# EAGLE schematic protoTop (EAGLE 5.06)

## Sheet 1 of 5
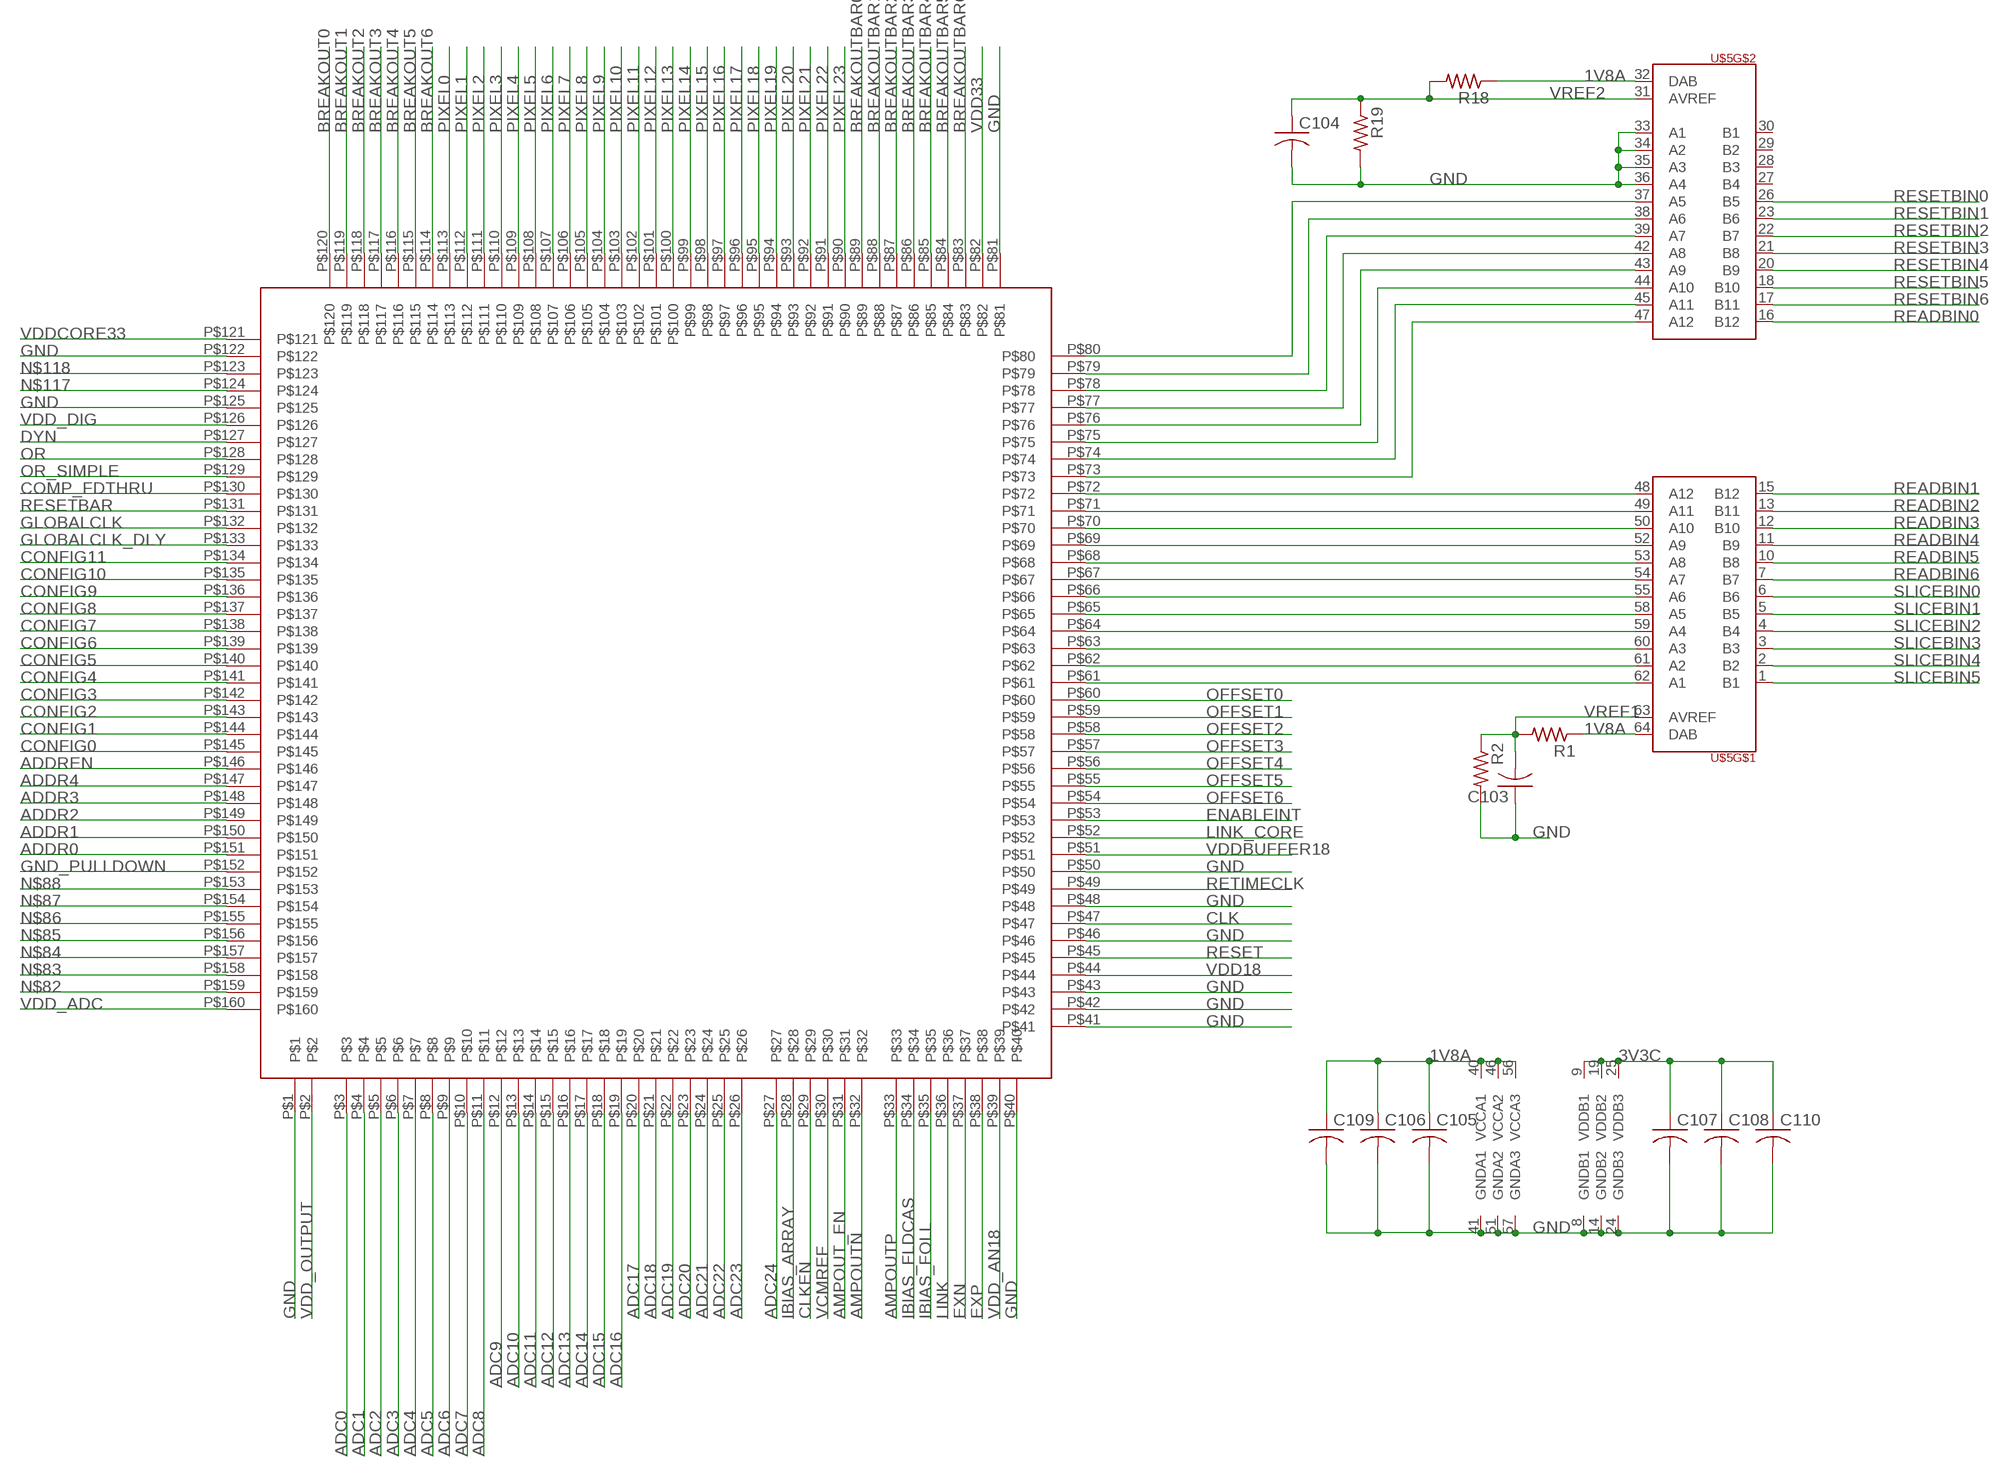
[diagram p0: schematic, sheet 1]

### Parts
C103  C-USC0603  [C0603]
C104  C-USC0603  [C0603]
C105  C-USC0603  [C0603]
C106  C-USC0603  [C0603]
C107  C-USC0603  [C0603]
C108  C-USC0603  [C0603]
C109  C-USC0603  [C0603]
C110  C-USC0603  [C0603]
R1  R-US_R0603  [R0603]
R2  R-US_R0603  [R0603]
R18  R-US_R0603  [R0603]
R19  R-US_R0603  [R0603]
U$1  DEC09_18RF  [CQZ160]
U$5  74HSTL1212  [TSSOP-64]

### Nets
1V8A: C105.1 C106.1 C109.1 R1.1 R18.1 U$5.32(DAB) U$5.40(VCCA1) U$5.46(VCCA2) U$5.56(VCCA3) U$5.64(DAB) ; also sheet 2,4,5
3V3C: C107.1 C108.1 C110.1 U$5.9(VDDB1) U$5.19(VDDB2) U$5.25(VDDB3) ; also sheet 4
ADC0: U$1.P$3 ; also sheet 4
ADC1: U$1.P$4 ; also sheet 4
ADC2: U$1.P$5 ; also sheet 4
ADC3: U$1.P$6 ; also sheet 4
ADC4: U$1.P$7 ; also sheet 4
ADC5: U$1.P$8 ; also sheet 4
ADC6: U$1.P$9 ; also sheet 4
ADC7: U$1.P$10 ; also sheet 4
ADC8: U$1.P$11 ; also sheet 4
ADC9: U$1.P$12 ; also sheet 4
ADC10: U$1.P$13 ; also sheet 4
ADC11: U$1.P$14 ; also sheet 4
ADC12: U$1.P$15 ; also sheet 4
ADC13: U$1.P$16 ; also sheet 4
ADC14: U$1.P$17 ; also sheet 4
ADC15: U$1.P$18 ; also sheet 4
ADC16: U$1.P$19 ; also sheet 4
ADC17: U$1.P$20 ; also sheet 4
ADC18: U$1.P$21 ; also sheet 4
ADC19: U$1.P$22 ; also sheet 4
ADC20: U$1.P$23 ; also sheet 4
ADC21: U$1.P$24 ; also sheet 4
ADC22: U$1.P$25 ; also sheet 4
ADC23: U$1.P$26 ; also sheet 4
ADC24: U$1.P$27 ; also sheet 4
ADDR0: U$1.P$151 ; also sheet 4
ADDR1: U$1.P$150 ; also sheet 4
ADDR2: U$1.P$149 ; also sheet 4
ADDR3: U$1.P$148 ; also sheet 4
ADDR4: U$1.P$147 ; also sheet 4
ADDREN: U$1.P$146 ; also sheet 4
AMPOUT_EN: U$1.P$31 ; also sheet 4
AMPOUTN: U$1.P$32 ; also sheet 4
AMPOUTP: U$1.P$33 ; also sheet 4
BREAKOUT0: U$1.P$120 ; also sheet 4
BREAKOUT1: U$1.P$119 ; also sheet 4
BREAKOUT2: U$1.P$118 ; also sheet 4
BREAKOUT3: U$1.P$117 ; also sheet 4
BREAKOUT4: U$1.P$116 ; also sheet 4
BREAKOUT5: U$1.P$115 ; also sheet 4
BREAKOUT6: U$1.P$114 ; also sheet 4
BREAKOUTBAR0: U$1.P$89 ; also sheet 4
BREAKOUTBAR1: U$1.P$88 ; also sheet 4
BREAKOUTBAR2: U$1.P$87 ; also sheet 4
BREAKOUTBAR3: U$1.P$86 ; also sheet 4
BREAKOUTBAR4: U$1.P$85 ; also sheet 4
BREAKOUTBAR5: U$1.P$84 ; also sheet 4
BREAKOUTBAR6: U$1.P$83 ; also sheet 4
CLK: U$1.P$47 ; also sheet 2
CLKEN: U$1.P$29 ; also sheet 4
COMP_FDTHRU: U$1.P$130 ; also sheet 4
CONFIG0: U$1.P$145 ; also sheet 4
CONFIG1: U$1.P$144 ; also sheet 4
CONFIG2: U$1.P$143 ; also sheet 4
CONFIG3: U$1.P$142 ; also sheet 4
CONFIG4: U$1.P$141 ; also sheet 4
CONFIG5: U$1.P$140 ; also sheet 4
CONFIG6: U$1.P$139 ; also sheet 4
CONFIG7: U$1.P$138 ; also sheet 4
CONFIG8: U$1.P$137 ; also sheet 4
CONFIG9: U$1.P$136 ; also sheet 4
CONFIG10: U$1.P$135 ; also sheet 4
CONFIG11: U$1.P$134 ; also sheet 4
DYN: U$1.P$127 ; also sheet 4
ENABLEINT: U$1.P$53 ; also sheet 4
EXN: U$1.P$37 ; also sheet 4
EXP: U$1.P$38 ; also sheet 4
GLOBALCLK: U$1.P$132 ; also sheet 4
GLOBALCLK_DLY: U$1.P$133 ; also sheet 4
GND: C103.1 C104.2 C105.2 C106.2 C107.2 C108.2 C109.2 C110.2 R2.2 R19.2 U$1.P$1 U$1.P$40 U$1.P$41 U$1.P$42 U$1.P$43 U$1.P$46 U$1.P$48 U$1.P$50 U$1.P$81 U$1.P$122 U$1.P$125 U$5.8(GNDB1) U$5.14(GNDB2) U$5.24(GNDB3) U$5.33(A1) U$5.34(A2) U$5.35(A3) U$5.36(A4) U$5.41(GNDA1) U$5.51(GNDA2) U$5.57(GNDA3) ; also sheet 2,3,4,5
GND_PULLDOWN: U$1.P$152 ; also sheet 4
IBIAS_ARRAY: U$1.P$28 ; also sheet 3,4
IBIAS_FLDCAS: U$1.P$34 ; also sheet 3,4
IBIAS_FOLL: U$1.P$35 ; also sheet 3,4
LINK: U$1.P$36 ; also sheet 4
LINK_CORE: U$1.P$52 ; also sheet 4
N$13: U$1.P$61 U$5.62(A1)
N$17: U$1.P$62 U$5.61(A2)
N$18: U$1.P$63 U$5.60(A3)
N$26: U$1.P$64 U$5.59(A4)
N$27: U$1.P$65 U$5.58(A5)
N$28: U$1.P$66 U$5.55(A6)
N$32: U$1.P$72 U$5.48(A12)
N$34: U$1.P$71 U$5.49(A11)
N$35: U$1.P$70 U$5.50(A10)
N$36: U$1.P$69 U$5.52(A9)
N$37: U$1.P$68 U$5.53(A8)
N$38: U$1.P$67 U$5.54(A7)
N$39: U$1.P$73 U$5.47(A12)
N$41: U$1.P$74 U$5.45(A11)
N$42: U$1.P$75 U$5.44(A10)
N$43: U$1.P$76 U$5.43(A9)
N$44: U$1.P$77 U$5.42(A8)
N$45: U$1.P$78 U$5.39(A7)
N$46: U$1.P$79 U$5.38(A6)
N$47: U$1.P$80 U$5.37(A5)
N$82: U$1.P$159
N$83: U$1.P$158
N$84: U$1.P$157
N$85: U$1.P$156
N$86: U$1.P$155
N$87: U$1.P$154
N$88: U$1.P$153
N$117: U$1.P$124
N$118: U$1.P$123
OFFSET0: U$1.P$60 ; also sheet 4
OFFSET1: U$1.P$59 ; also sheet 4
OFFSET2: U$1.P$58 ; also sheet 4
OFFSET3: U$1.P$57 ; also sheet 4
OFFSET4: U$1.P$56 ; also sheet 4
OFFSET5: U$1.P$55 ; also sheet 4
OFFSET6: U$1.P$54 ; also sheet 4
OR: U$1.P$128 ; also sheet 4
OR_SIMPLE: U$1.P$129 ; also sheet 4
PIXEL0: U$1.P$113 ; also sheet 4
PIXEL1: U$1.P$112 ; also sheet 4
PIXEL2: U$1.P$111 ; also sheet 4
PIXEL3: U$1.P$110 ; also sheet 4
PIXEL4: U$1.P$109 ; also sheet 4
PIXEL5: U$1.P$108 ; also sheet 4
PIXEL6: U$1.P$107 ; also sheet 4
PIXEL7: U$1.P$106 ; also sheet 4
PIXEL8: U$1.P$105 ; also sheet 4
PIXEL9: U$1.P$104 ; also sheet 4
PIXEL10: U$1.P$103 ; also sheet 4
PIXEL11: U$1.P$102 ; also sheet 4
PIXEL12: U$1.P$101 ; also sheet 4
PIXEL13: U$1.P$100 ; also sheet 4
PIXEL14: U$1.P$99 ; also sheet 4
PIXEL15: U$1.P$98 ; also sheet 4
PIXEL16: U$1.P$97 ; also sheet 4
PIXEL17: U$1.P$96 ; also sheet 4
PIXEL18: U$1.P$95 ; also sheet 4
PIXEL19: U$1.P$94 ; also sheet 4
PIXEL20: U$1.P$93 ; also sheet 4
PIXEL21: U$1.P$92 ; also sheet 4
PIXEL22: U$1.P$91 ; also sheet 4
PIXEL23: U$1.P$90 ; also sheet 4
READBIN0: U$5.16(B12) ; also sheet 4
READBIN1: U$5.15(B12) ; also sheet 4
READBIN2: U$5.13(B11) ; also sheet 4
READBIN3: U$5.12(B10) ; also sheet 4
READBIN4: U$5.11(B9) ; also sheet 4
READBIN5: U$5.10(B8) ; also sheet 4
READBIN6: U$5.7(B7) ; also sheet 4
RESET: U$1.P$45 ; also sheet 4
RESETBAR: U$1.P$131 ; also sheet 4
RESETBIN0: U$5.26(B5) ; also sheet 4
RESETBIN1: U$5.23(B6) ; also sheet 4
RESETBIN2: U$5.22(B7) ; also sheet 4
RESETBIN3: U$5.21(B8) ; also sheet 4
RESETBIN4: U$5.20(B9) ; also sheet 4
RESETBIN5: U$5.18(B10) ; also sheet 4
RESETBIN6: U$5.17(B11) ; also sheet 4
RETIMECLK: U$1.P$49 ; also sheet 2
SLICEBIN0: U$5.6(B6) ; also sheet 4
SLICEBIN1: U$5.5(B5) ; also sheet 4
SLICEBIN2: U$5.4(B4) ; also sheet 4
SLICEBIN3: U$5.3(B3) ; also sheet 4
SLICEBIN4: U$5.2(B2) ; also sheet 4
SLICEBIN5: U$5.1(B1) ; also sheet 4
VCMREF: U$1.P$30 ; also sheet 4
VDD18: U$1.P$44 ; also sheet 3,5
VDD33: U$1.P$82 ; also sheet 3,5
VDD_ADC: U$1.P$160 ; also sheet 3,5
VDD_AN18: U$1.P$39 ; also sheet 3,5
VDD_DIG: U$1.P$126 ; also sheet 3,5
VDD_OUTPUT: U$1.P$2 ; also sheet 3,5
VDDBUFFER18: U$1.P$51 ; also sheet 3,5
VDDCORE33: U$1.P$121 ; also sheet 3,5
VREF1: C103.2 R1.2 R2.1 U$5.63(AVREF)
VREF2: C104.1 R18.2 R19.1 U$5.31(AVREF)
Unconnected: U$5.27(B4) U$5.28(B3) U$5.29(B2) U$5.30(B1)

## Sheet 2 of 5
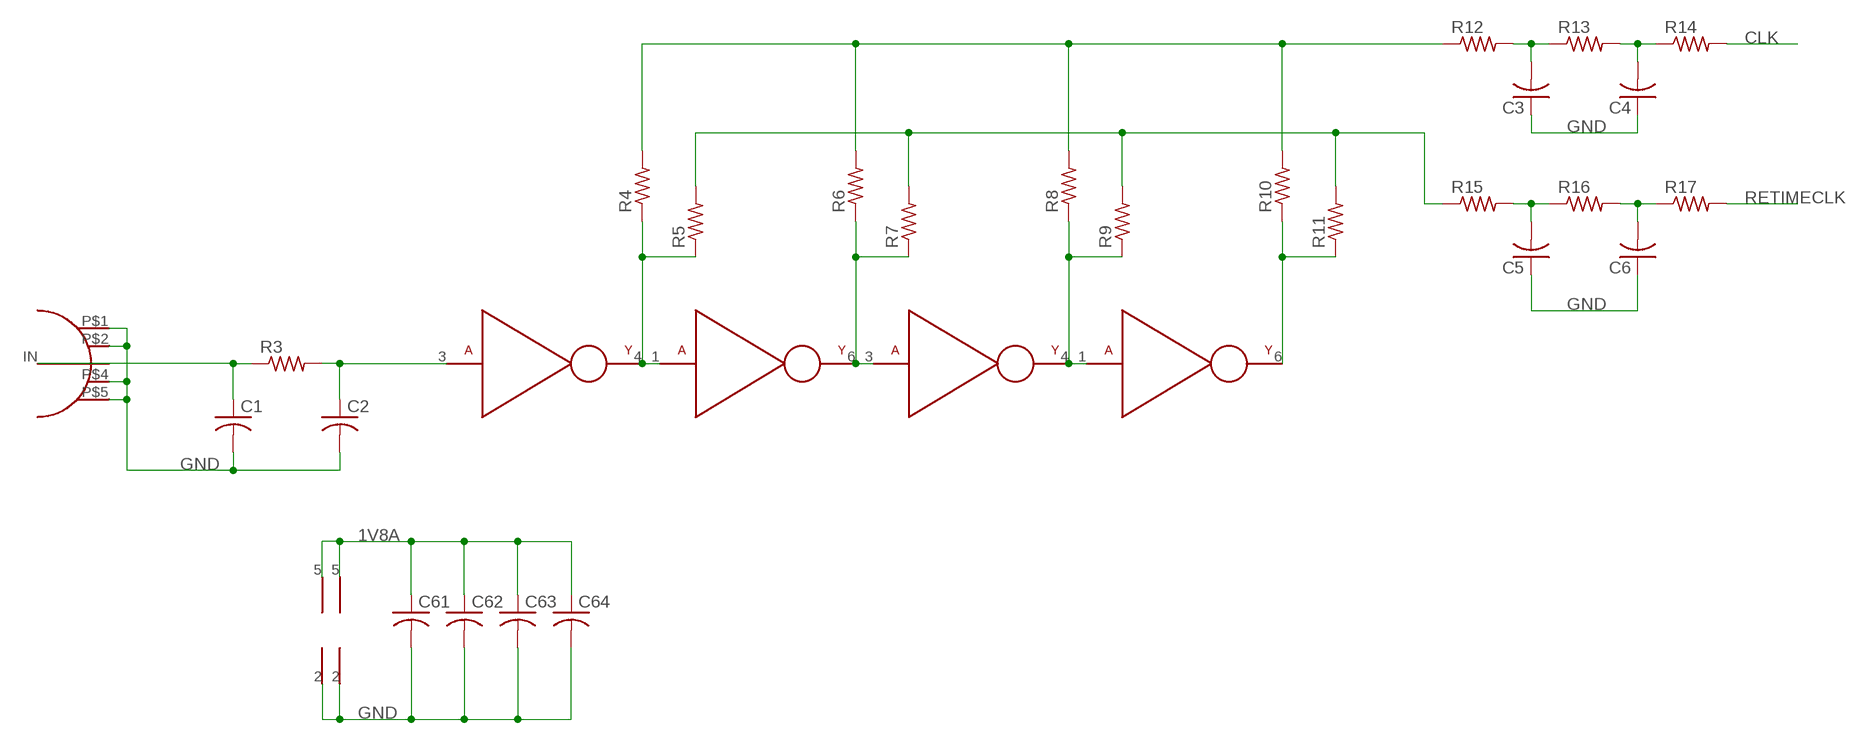
[diagram p1: schematic, sheet 2]

### Parts
C1  C-USC0603  [C0603]
C2  C-USC0603  [C0603]
C3  C-USC0603  [C0603]
C4  C-USC0603  [C0603]
C5  C-USC0603  [C0603]
C6  C-USC0603  [C0603]
C61  C-USC0603  [C0603]
C62  C-USC0603  [C0603]
C63  C-USC0603  [C0603]
C64  C-USC0603  [C0603]
R3  R-US_R0603  [R0603]
R4  R-US_R0603  [R0603]
R5  R-US_R0603  [R0603]
R6  R-US_R0603  [R0603]
R7  R-US_R0603  [R0603]
R8  R-US_R0603  [R0603]
R9  R-US_R0603  [R0603]
R10  R-US_R0603  [R0603]
R11  R-US_R0603  [R0603]
R12  R-US_R0603  [R0603]
R13  R-US_R0603  [R0603]
R14  R-US_R0603  [R0603]
R15  R-US_R0603  [R0603]
R16  R-US_R0603  [R0603]
R17  R-US_R0603  [R0603]
U$2  J658  [SMA_J658]
U$3  7WZU04  [SC70-6]
U$4  7WZU04  [SC70-6]

### Nets
1V8A: C61.1 C62.1 C63.1 C64.1 U$3.5(VDD) U$4.5(VDD) ; also sheet 1,4,5
CLK: R14.2 ; also sheet 1
GND: C1.2 C2.2 C3.1 C4.1 C5.1 C6.1 C61.2 C62.2 C63.2 C64.2 U$2.P$1(GNDA) U$2.P$2(GNDB) U$2.P$4(GNDC) U$2.P$5(GNDD) U$3.2(GND) U$4.2(GND) ; also sheet 1,3,4,5
N$1: R4.1 R5.1 U$3.1(A) U$3.4(Y)
N$3: C1.1 R3.1 U$2.IN
N$4: C2.1 R3.2 U$3.3(A)
N$6: R6.1 R7.1 U$3.6(Y) U$4.3(A)
N$7: R8.1 R9.1 U$4.1(A) U$4.4(Y)
N$8: R10.1 R11.1 U$4.6(Y)
N$9: R4.2 R6.2 R8.2 R10.2 R12.1
N$10: R5.2 R7.2 R9.2 R11.2 R15.1
N$11: C3.2 R12.2 R13.1
N$12: C4.2 R13.2 R14.1
N$14: C5.2 R15.2 R16.1
N$15: C6.2 R16.2 R17.1
RETIMECLK: R17.2 ; also sheet 1

## Sheet 3 of 5
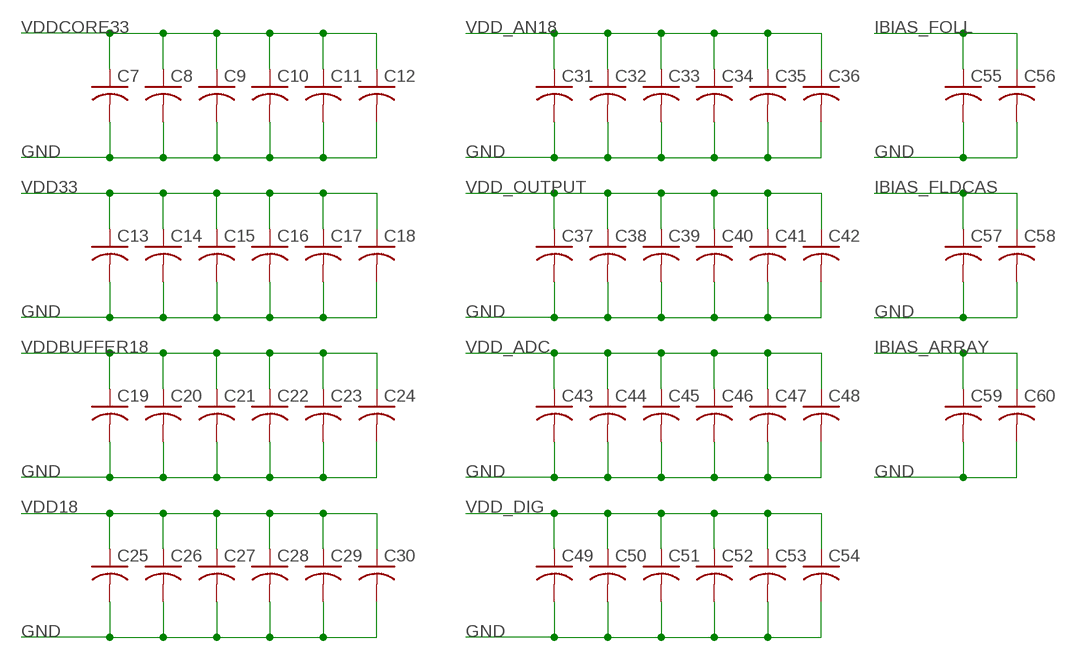
[diagram p2: schematic, sheet 3]

### Parts
C7  C-USC0603  [C0603]
C8  C-USC0603  [C0603]
C9  C-USC0603  [C0603]
C10  C-USC0603  [C0603]
C11  C-USC0603  [C0603]
C12  C-USC0603  [C0603]
C13  C-USC0603  [C0603]
C14  C-USC0603  [C0603]
C15  C-USC0603  [C0603]
C16  C-USC0603  [C0603]
C17  C-USC0603  [C0603]
C18  C-USC0603  [C0603]
C19  C-USC0603  [C0603]
C20  C-USC0603  [C0603]
C21  C-USC0603  [C0603]
C22  C-USC0603  [C0603]
C23  C-USC0603  [C0603]
C24  C-USC0603  [C0603]
C25  C-USC0603  [C0603]
C26  C-USC0603  [C0603]
C27  C-USC0603  [C0603]
C28  C-USC0603  [C0603]
C29  C-USC0603  [C0603]
C30  C-USC0603  [C0603]
C31  C-USC0603  [C0603]
C32  C-USC0603  [C0603]
C33  C-USC0603  [C0603]
C34  C-USC0603  [C0603]
C35  C-USC0603  [C0603]
C36  C-USC0603  [C0603]
C37  C-USC0603  [C0603]
C38  C-USC0603  [C0603]
C39  C-USC0603  [C0603]
C40  C-USC0603  [C0603]
C41  C-USC0603  [C0603]
C42  C-USC0603  [C0603]
C43  C-USC0603  [C0603]
C44  C-USC0603  [C0603]
C45  C-USC0603  [C0603]
C46  C-USC0603  [C0603]
C47  C-USC0603  [C0603]
C48  C-USC0603  [C0603]
C49  C-USC0603  [C0603]
C50  C-USC0603  [C0603]
C51  C-USC0603  [C0603]
C52  C-USC0603  [C0603]
C53  C-USC0603  [C0603]
C54  C-USC0603  [C0603]
C55  C-USC0603  [C0603]
C56  C-USC0603  [C0603]
C57  C-USC0603  [C0603]
C58  C-USC0603  [C0603]
C59  C-USC0603  [C0603]
C60  C-USC0603  [C0603]

### Nets
GND: C7.2 C8.2 C9.2 C10.2 C11.2 C12.2 C13.2 C14.2 C15.2 C16.2 C17.2 C18.2 C19.2 C20.2 C21.2 C22.2 C23.2 C24.2 C25.2 C26.2 C27.2 C28.2 C29.2 C30.2 C31.2 C32.2 C33.2 C34.2 C35.2 C36.2 C37.2 C38.2 C39.2 C40.2 C41.2 C42.2 C43.2 C44.2 C45.2 C46.2 C47.2 C48.2 C49.2 C50.2 C51.2 C52.2 C53.2 C54.2 C55.2 C56.2 C57.2 C58.2 C59.2 C60.2 ; also sheet 1,2,4,5
IBIAS_ARRAY: C59.1 C60.1 ; also sheet 1,4
IBIAS_FLDCAS: C57.1 C58.1 ; also sheet 1,4
IBIAS_FOLL: C55.1 C56.1 ; also sheet 1,4
VDD18: C25.1 C26.1 C27.1 C28.1 C29.1 C30.1 ; also sheet 1,5
VDD33: C13.1 C14.1 C15.1 C16.1 C17.1 C18.1 ; also sheet 1,5
VDD_ADC: C43.1 C44.1 C45.1 C46.1 C47.1 C48.1 ; also sheet 1,5
VDD_AN18: C31.1 C32.1 C33.1 C34.1 C35.1 C36.1 ; also sheet 1,5
VDD_DIG: C49.1 C50.1 C51.1 C52.1 C53.1 C54.1 ; also sheet 1,5
VDD_OUTPUT: C37.1 C38.1 C39.1 C40.1 C41.1 C42.1 ; also sheet 1,5
VDDBUFFER18: C19.1 C20.1 C21.1 C22.1 C23.1 C24.1 ; also sheet 1,5
VDDCORE33: C7.1 C8.1 C9.1 C10.1 C11.1 C12.1 ; also sheet 1,5

## Sheet 4 of 5
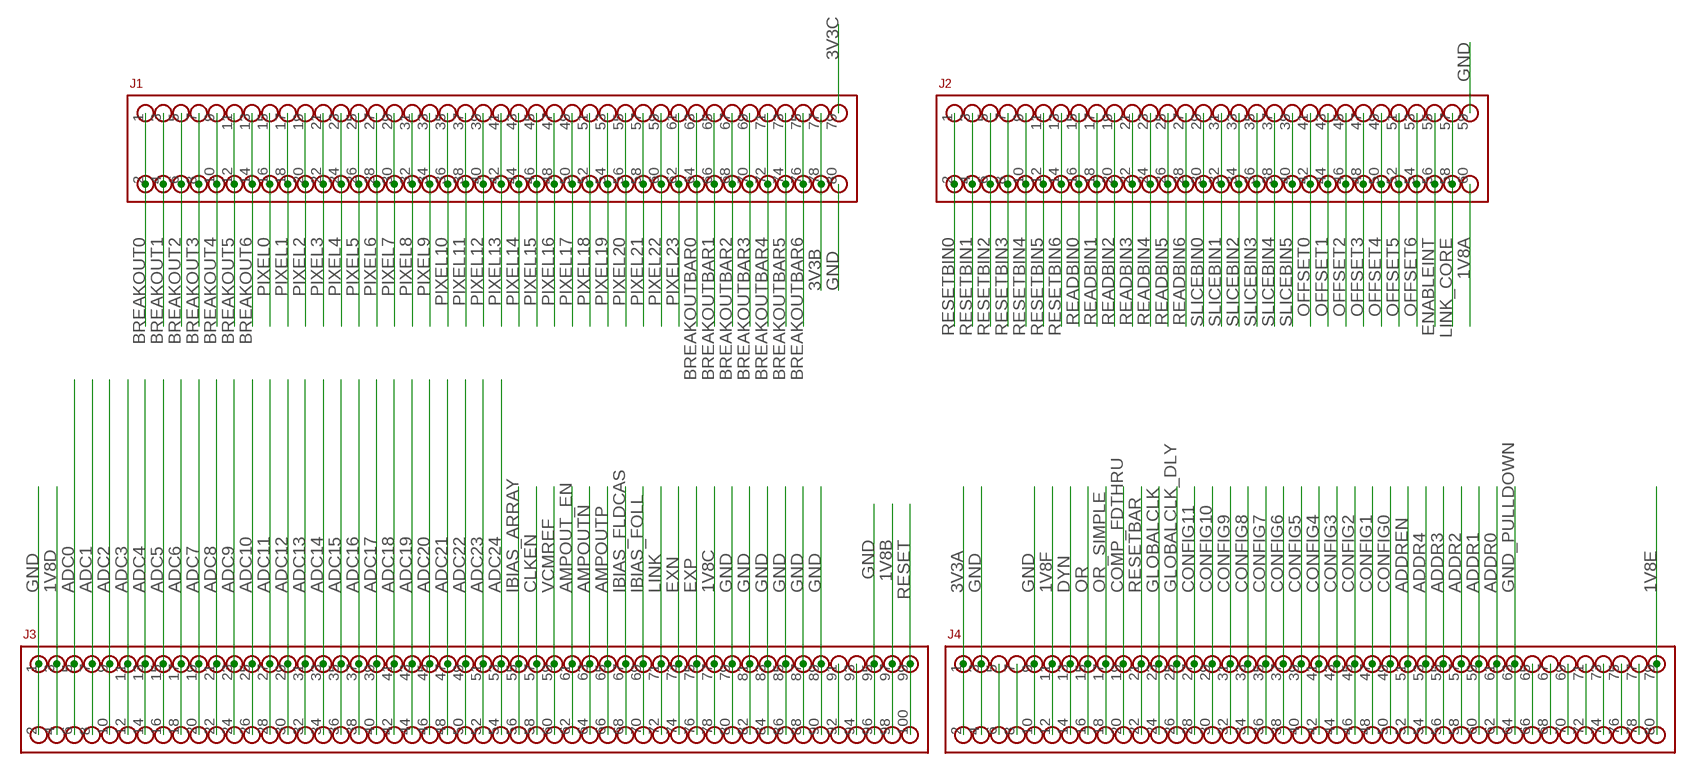
[diagram p3: schematic, sheet 4]

### Parts
J1  AMPMODU50-80  [AMPMODU50-80]
J2  AMPMODU50-60  [AMPMODU50-60]
J3  AMPMODU50-100  [AMPMODU50-100]
J4  AMPMODU50-80  [AMPMODU50-80]

### Nets
1V8A: J2.60 ; also sheet 1,2,5
1V8B: J3.97 J3.98 ; also sheet 5
1V8C: J3.77 J3.78 ; also sheet 5
1V8D: J3.3 J3.4 ; also sheet 5
1V8E: J4.79 J4.80 ; also sheet 5
1V8F: J4.11 J4.12 ; also sheet 5
3V3A: J4.1 J4.2 ; also sheet 5
3V3B: J1.77 J1.78 ; also sheet 5
3V3C: J1.79 ; also sheet 1
ADC0: J3.5 J3.6 ; also sheet 1
ADC1: J3.7 J3.8 ; also sheet 1
ADC2: J3.9 J3.10 ; also sheet 1
ADC3: J3.11 J3.12 ; also sheet 1
ADC4: J3.13 J3.14 ; also sheet 1
ADC5: J3.15 J3.16 ; also sheet 1
ADC6: J3.17 J3.18 ; also sheet 1
ADC7: J3.19 J3.20 ; also sheet 1
ADC8: J3.21 J3.22 ; also sheet 1
ADC9: J3.23 J3.24 ; also sheet 1
ADC10: J3.25 J3.26 ; also sheet 1
ADC11: J3.27 J3.28 ; also sheet 1
ADC12: J3.29 J3.30 ; also sheet 1
ADC13: J3.31 J3.32 ; also sheet 1
ADC14: J3.33 J3.34 ; also sheet 1
ADC15: J3.35 J3.36 ; also sheet 1
ADC16: J3.37 J3.38 ; also sheet 1
ADC17: J3.39 J3.40 ; also sheet 1
ADC18: J3.41 J3.42 ; also sheet 1
ADC19: J3.43 J3.44 ; also sheet 1
ADC20: J3.45 J3.46 ; also sheet 1
ADC21: J3.47 J3.48 ; also sheet 1
ADC22: J3.49 J3.50 ; also sheet 1
ADC23: J3.51 J3.52 ; also sheet 1
ADC24: J3.53 J3.54 ; also sheet 1
ADDR0: J4.61 J4.62 ; also sheet 1
ADDR1: J4.59 J4.60 ; also sheet 1
ADDR2: J4.57 J4.58 ; also sheet 1
ADDR3: J4.55 J4.56 ; also sheet 1
ADDR4: J4.53 J4.54 ; also sheet 1
ADDREN: J4.51 J4.52 ; also sheet 1
AMPOUT_EN: J3.61 J3.62 ; also sheet 1
AMPOUTN: J3.63 J3.64 ; also sheet 1
AMPOUTP: J3.65 J3.66 ; also sheet 1
BREAKOUT0: J1.1 J1.2 ; also sheet 1
BREAKOUT1: J1.3 J1.4 ; also sheet 1
BREAKOUT2: J1.5 J1.6 ; also sheet 1
BREAKOUT3: J1.7 J1.8 ; also sheet 1
BREAKOUT4: J1.9 J1.10 ; also sheet 1
BREAKOUT5: J1.11 J1.12 ; also sheet 1
BREAKOUT6: J1.13 J1.14 ; also sheet 1
BREAKOUTBAR0: J1.63 J1.64 ; also sheet 1
BREAKOUTBAR1: J1.65 J1.66 ; also sheet 1
BREAKOUTBAR2: J1.67 J1.68 ; also sheet 1
BREAKOUTBAR3: J1.69 J1.70 ; also sheet 1
BREAKOUTBAR4: J1.71 J1.72 ; also sheet 1
BREAKOUTBAR5: J1.73 J1.74 ; also sheet 1
BREAKOUTBAR6: J1.75 J1.76 ; also sheet 1
CLKEN: J3.57 J3.58 ; also sheet 1
COMP_FDTHRU: J4.19 J4.20 ; also sheet 1
CONFIG0: J4.49 J4.50 ; also sheet 1
CONFIG1: J4.47 J4.48 ; also sheet 1
CONFIG2: J4.45 J4.46 ; also sheet 1
CONFIG3: J4.43 J4.44 ; also sheet 1
CONFIG4: J4.41 J4.42 ; also sheet 1
CONFIG5: J4.39 J4.40 ; also sheet 1
CONFIG6: J4.37 J4.38 ; also sheet 1
CONFIG7: J4.35 J4.36 ; also sheet 1
CONFIG8: J4.33 J4.34 ; also sheet 1
CONFIG9: J4.31 J4.32 ; also sheet 1
CONFIG10: J4.29 J4.30 ; also sheet 1
CONFIG11: J4.27 J4.28 ; also sheet 1
DYN: J4.13 J4.14 ; also sheet 1
ENABLEINT: J2.55 J2.56 ; also sheet 1
EXN: J3.73 J3.74 ; also sheet 1
EXP: J3.75 J3.76 ; also sheet 1
GLOBALCLK: J4.23 J4.24 ; also sheet 1
GLOBALCLK_DLY: J4.25 J4.26 ; also sheet 1
GND: J1.80 J2.59 J3.1 J3.2 J3.79 J3.80 J3.81 J3.82 J3.83 J3.84 J3.85 J3.86 J3.87 J3.88 J3.89 J3.90 J3.95 J3.96 J4.3 J4.4 J4.9 J4.10 ; also sheet 1,2,3,5
GND_PULLDOWN: J4.63 J4.64 ; also sheet 1
IBIAS_ARRAY: J3.55 J3.56 ; also sheet 1,3
IBIAS_FLDCAS: J3.67 J3.68 ; also sheet 1,3
IBIAS_FOLL: J3.69 J3.70 ; also sheet 1,3
LINK: J3.71 J3.72 ; also sheet 1
LINK_CORE: J2.57 J2.58 ; also sheet 1
N$2: J4.5 J4.6
N$5: J4.7 J4.8
N$19: J4.65 J4.66
N$20: J4.67 J4.68
N$21: J4.69 J4.70
N$22: J4.71 J4.72
N$23: J4.73 J4.74
N$24: J4.75 J4.76
N$25: J4.77 J4.78
N$30: J3.91 J3.92
N$31: J3.93 J3.94
OFFSET0: J2.41 J2.42 ; also sheet 1
OFFSET1: J2.43 J2.44 ; also sheet 1
OFFSET2: J2.45 J2.46 ; also sheet 1
OFFSET3: J2.47 J2.48 ; also sheet 1
OFFSET4: J2.49 J2.50 ; also sheet 1
OFFSET5: J2.51 J2.52 ; also sheet 1
OFFSET6: J2.53 J2.54 ; also sheet 1
OR: J4.15 J4.16 ; also sheet 1
OR_SIMPLE: J4.17 J4.18 ; also sheet 1
PIXEL0: J1.15 J1.16 ; also sheet 1
PIXEL1: J1.17 J1.18 ; also sheet 1
PIXEL2: J1.19 J1.20 ; also sheet 1
PIXEL3: J1.21 J1.22 ; also sheet 1
PIXEL4: J1.23 J1.24 ; also sheet 1
PIXEL5: J1.25 J1.26 ; also sheet 1
PIXEL6: J1.27 J1.28 ; also sheet 1
PIXEL7: J1.29 J1.30 ; also sheet 1
PIXEL8: J1.31 J1.32 ; also sheet 1
PIXEL9: J1.33 J1.34 ; also sheet 1
PIXEL10: J1.35 J1.36 ; also sheet 1
PIXEL11: J1.37 J1.38 ; also sheet 1
PIXEL12: J1.39 J1.40 ; also sheet 1
PIXEL13: J1.41 J1.42 ; also sheet 1
PIXEL14: J1.43 J1.44 ; also sheet 1
PIXEL15: J1.45 J1.46 ; also sheet 1
PIXEL16: J1.47 J1.48 ; also sheet 1
PIXEL17: J1.49 J1.50 ; also sheet 1
PIXEL18: J1.51 J1.52 ; also sheet 1
PIXEL19: J1.53 J1.54 ; also sheet 1
PIXEL20: J1.55 J1.56 ; also sheet 1
PIXEL21: J1.57 J1.58 ; also sheet 1
PIXEL22: J1.59 J1.60 ; also sheet 1
PIXEL23: J1.61 J1.62 ; also sheet 1
READBIN0: J2.15 J2.16 ; also sheet 1
READBIN1: J2.17 J2.18 ; also sheet 1
READBIN2: J2.19 J2.20 ; also sheet 1
READBIN3: J2.21 J2.22 ; also sheet 1
READBIN4: J2.23 J2.24 ; also sheet 1
READBIN5: J2.25 J2.26 ; also sheet 1
READBIN6: J2.27 J2.28 ; also sheet 1
RESET: J3.99 J3.100 ; also sheet 1
RESETBAR: J4.21 J4.22 ; also sheet 1
RESETBIN0: J2.1 J2.2 ; also sheet 1
RESETBIN1: J2.3 J2.4 ; also sheet 1
RESETBIN2: J2.5 J2.6 ; also sheet 1
RESETBIN3: J2.7 J2.8 ; also sheet 1
RESETBIN4: J2.9 J2.10 ; also sheet 1
RESETBIN5: J2.11 J2.12 ; also sheet 1
RESETBIN6: J2.13 J2.14 ; also sheet 1
SLICEBIN0: J2.29 J2.30 ; also sheet 1
SLICEBIN1: J2.31 J2.32 ; also sheet 1
SLICEBIN2: J2.33 J2.34 ; also sheet 1
SLICEBIN3: J2.35 J2.36 ; also sheet 1
SLICEBIN4: J2.37 J2.38 ; also sheet 1
SLICEBIN5: J2.39 J2.40 ; also sheet 1
VCMREF: J3.59 J3.60 ; also sheet 1

## Sheet 5 of 5
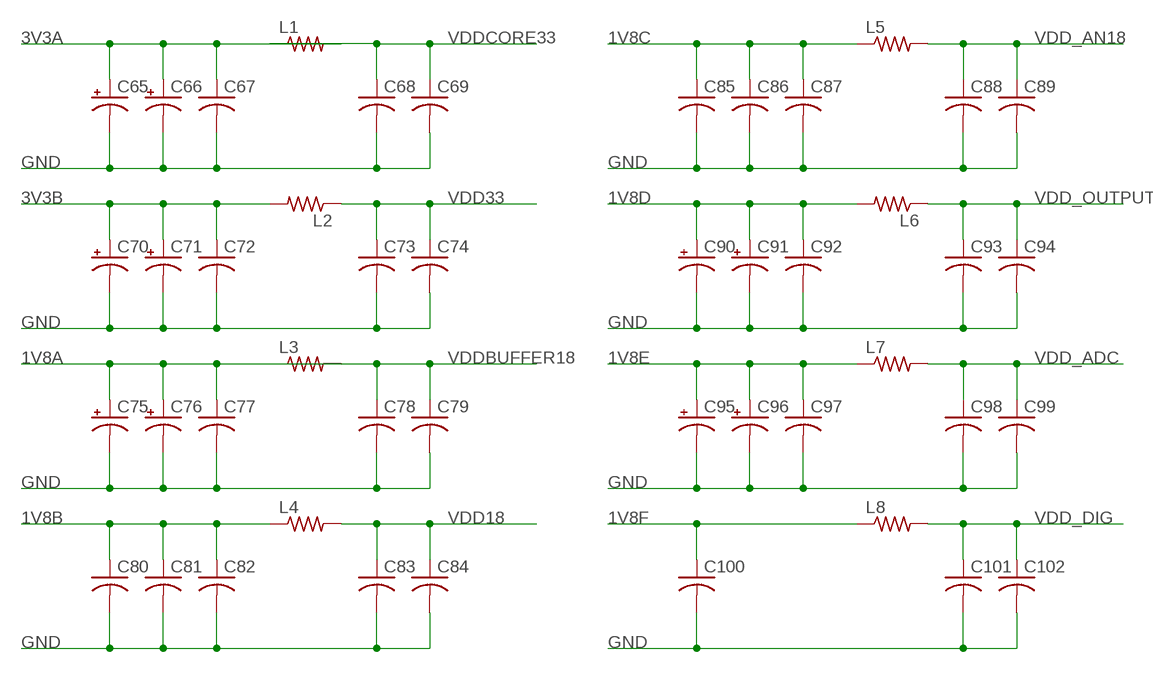
[diagram p4: schematic, sheet 5]

### Parts
C65  CPOL-USE/7260-38R  [E/7260-38R]
C66  CPOL-USC/6032-28R  [C/6032-28R]
C67  C-USC1210  [C1210]
C68  C-USC0603  [C0603]
C69  C-USC0603  [C0603]
C70  CPOL-USE/7260-38R  [E/7260-38R]
C71  CPOL-USC/6032-28R  [C/6032-28R]
C72  C-USC1210  [C1210]
C73  C-USC0603  [C0603]
C74  C-USC0603  [C0603]
C75  CPOL-USC/6032-28R  [C/6032-28R]
C76  CPOL-USE/7260-38R  [E/7260-38R]
C77  C-USC0603  [C0603]
C78  C-USC0603  [C0603]
C79  C-USC0603  [C0603]
C80  C-USC1210  [C1210]
C81  C-USC0603  [C0603]
C82  C-USC0603  [C0603]
C83  C-USC0603  [C0603]
C84  C-USC0603  [C0603]
C85  C-USC1210  [C1210]
C86  C-USC0603  [C0603]
C87  C-USC0603  [C0603]
C88  C-USC0603  [C0603]
C89  C-USC0603  [C0603]
C90  CPOL-USC/6032-28R  [C/6032-28R]
C91  CPOL-USC/6032-28R  [C/6032-28R]
C92  C-USC1210  [C1210]
C93  C-USC0603  [C0603]
C94  C-USC0603  [C0603]
C95  CPOL-USE/7260-38R  [E/7260-38R]
C96  CPOL-USC/6032-28R  [C/6032-28R]
C97  C-USC1210  [C1210]
C98  C-USC0603  [C0603]
C99  C-USC0603  [C0603]
C100  C-USC1210  [C1210]
C101  C-USC0603  [C0603]
C102  C-USC0603  [C0603]
L1  R-US_R1206  [R1206]
L2  R-US_R1206  [R1206]
L3  R-US_R1206  [R1206]
L4  R-US_R1206  [R1206]
L5  R-US_R1206  [R1206]
L6  R-US_R1206  [R1206]
L7  R-US_R1206  [R1206]
L8  R-US_R1206  [R1206]

### Nets
1V8A: C75.+ C76.+ C77.1 L3.2 ; also sheet 1,2,4
1V8B: C80.1 C81.1 C82.1 L4.1 ; also sheet 4
1V8C: C85.1 C86.1 C87.1 L5.1 ; also sheet 4
1V8D: C90.+ C91.+ C92.1 L6.2 ; also sheet 4
1V8E: C95.+ C96.+ C97.1 L7.1 ; also sheet 4
1V8F: C100.1 L8.1 ; also sheet 4
3V3A: C65.+ C66.+ C67.1 L1.2 ; also sheet 4
3V3B: C70.+ C71.+ C72.1 L2.2 ; also sheet 4
GND: C65.- C66.- C67.2 C68.2 C69.2 C70.- C71.- C72.2 C73.2 C74.2 C75.- C76.- C77.2 C78.2 C79.2 C80.2 C81.2 C82.2 C83.2 C84.2 C85.2 C86.2 C87.2 C88.2 C89.2 C90.- C91.- C92.2 C93.2 C94.2 C95.- C96.- C97.2 C98.2 C99.2 C100.2 C101.2 C102.2 ; also sheet 1,2,3,4
VDD18: C83.1 C84.1 L4.2 ; also sheet 1,3
VDD33: C73.1 C74.1 L2.1 ; also sheet 1,3
VDD_ADC: C98.1 C99.1 L7.2 ; also sheet 1,3
VDD_AN18: C88.1 C89.1 L5.2 ; also sheet 1,3
VDD_DIG: C101.1 C102.1 L8.2 ; also sheet 1,3
VDD_OUTPUT: C93.1 C94.1 L6.1 ; also sheet 1,3
VDDBUFFER18: C78.1 C79.1 L3.1 ; also sheet 1,3
VDDCORE33: C68.1 C69.1 L1.1 ; also sheet 1,3

## Library data of the parts
C1-C64 C67-C69 C72-C74 C77-C89 C92-C94 C97-C110 = rcl:C-US: CAPACITOR, American symbol
C65 C66 C70 C71 C75 C76 C90 C91 C95 C96 = rcl:CPOL-US: POLARIZED CAPACITOR, American symbol
J1 J4 = CustomConn:AMPMODU50-80
J2 = CustomConn:AMPMODU50-60
J3 = CustomConn:AMPMODU50-100
L1-L8 R1-R19 = rcl:R-US_: RESISTOR, American symbol
U$1 = FabChip:DEC09_18RF
U$2 = CustomRF:J658
U$3 U$4 = CustomDigital:7WZU04
U$5 = CustomDigital:74HSTL1212